# EAGLE design SCH1001-001-005-320 - Controller Flash (EAGLE 9.4.2)
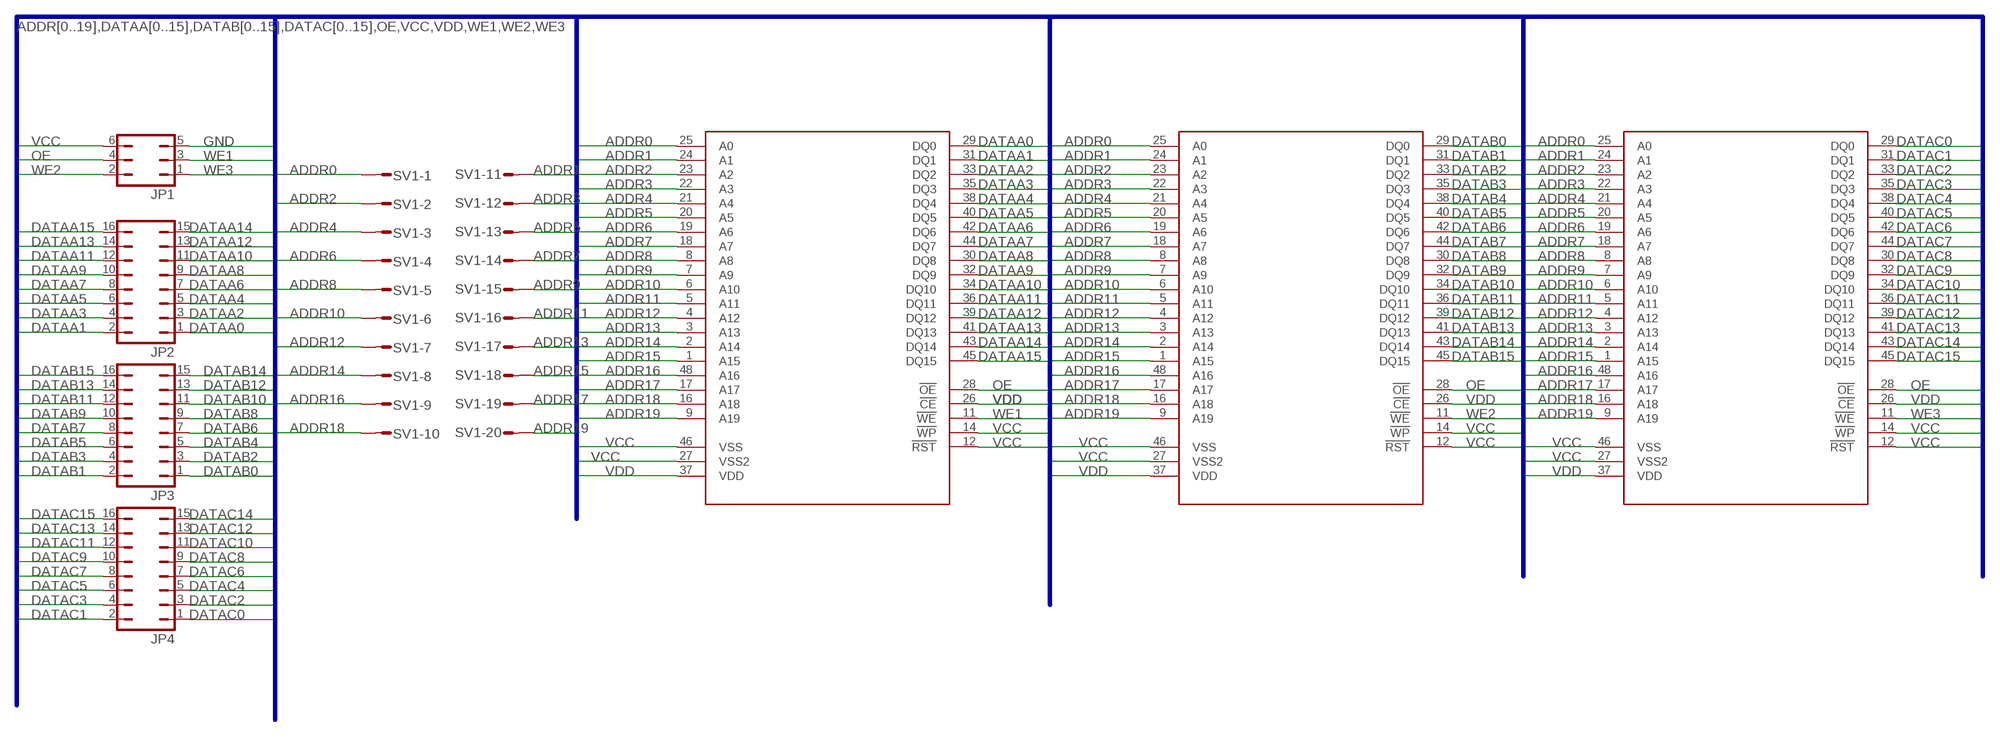
[diagram p0: schematic, sheet 1]

## Parts
JP1  JP3Q  [JP3Q]
JP2  JP8Q  [JP8Q]
JP3  JP8Q  [JP8Q]
JP4  JP8Q  [JP8Q]
SV1  S20P  [S20P]
U$1  SST39VF1602-70-4I-EKE  [TSOP48]
U$2  SST39VF1602-70-4I-EKE  [TSOP48]
U$3  SST39VF1602-70-4I-EKE  [TSOP48]

## Nets
ADDR0: SV1.1 U$1.25(A0) U$2.25(A0) U$3.25(A0)
ADDR1: SV1.11 U$1.24(A1) U$2.24(A1) U$3.24(A1)
ADDR2: SV1.2 U$1.23(A2) U$2.23(A2) U$3.23(A2)
ADDR3: SV1.12 U$1.22(A3) U$2.22(A3) U$3.22(A3)
ADDR4: SV1.3 U$1.21(A4) U$2.21(A4) U$3.21(A4)
ADDR5: SV1.13 U$1.20(A5) U$2.20(A5) U$3.20(A5)
ADDR6: SV1.4 U$1.19(A6) U$2.19(A6) U$3.19(A6)
ADDR7: SV1.14 U$1.18(A7) U$2.18(A7) U$3.18(A7)
ADDR8: SV1.5 U$1.8(A8) U$2.8(A8) U$3.8(A8)
ADDR9: SV1.15 U$1.7(A9) U$2.7(A9) U$3.7(A9)
ADDR10: SV1.6 U$1.6(A10) U$2.6(A10) U$3.6(A10)
ADDR11: SV1.16 U$1.5(A11) U$2.5(A11) U$3.5(A11)
ADDR12: SV1.7 U$1.4(A12) U$2.4(A12) U$3.4(A12)
ADDR13: SV1.17 U$1.3(A13) U$2.3(A13) U$3.3(A13)
ADDR14: SV1.8 U$1.2(A14) U$2.2(A14) U$3.2(A14)
ADDR15: SV1.18 U$1.1(A15) U$2.1(A15) U$3.1(A15)
ADDR16: SV1.9 U$1.48(A16) U$2.48(A16) U$3.48(A16)
ADDR17: SV1.19 U$1.17(A17) U$2.17(A17) U$3.17(A17)
ADDR18: SV1.10 U$1.16(A18) U$2.16(A18) U$3.16(A18)
ADDR19: SV1.20 U$1.9(A19) U$2.9(A19) U$3.9(A19)
DATAA0: JP2.1 U$1.29(DQ0)
DATAA1: JP2.2 U$1.31(DQ1)
DATAA2: JP2.3 U$1.33(DQ2)
DATAA3: JP2.4 U$1.35(DQ3)
DATAA4: JP2.5 U$1.38(DQ4)
DATAA5: JP2.6 U$1.40(DQ5)
DATAA6: JP2.7 U$1.42(DQ6)
DATAA7: JP2.8 U$1.44(DQ7)
DATAA8: JP2.9 U$1.30(DQ8)
DATAA9: JP2.10 U$1.32(DQ9)
DATAA10: JP2.11 U$1.34(DQ10)
DATAA11: JP2.12 U$1.36(DQ11)
DATAA12: JP2.13 U$1.39(DQ12)
DATAA13: JP2.14 U$1.41(DQ13)
DATAA14: JP2.15 U$1.43(DQ14)
DATAA15: JP2.16 U$1.45(DQ15)
DATAB0: JP3.1 U$2.29(DQ0)
DATAB1: JP3.2 U$2.31(DQ1)
DATAB2: JP3.3 U$2.33(DQ2)
DATAB3: JP3.4 U$2.35(DQ3)
DATAB4: JP3.5 U$2.38(DQ4)
DATAB5: JP3.6 U$2.40(DQ5)
DATAB6: JP3.7 U$2.42(DQ6)
DATAB7: JP3.8 U$2.44(DQ7)
DATAB8: JP3.9 U$2.30(DQ8)
DATAB9: JP3.10 U$2.32(DQ9)
DATAB10: JP3.11 U$2.34(DQ10)
DATAB11: JP3.12 U$2.36(DQ11)
DATAB12: JP3.13 U$2.39(DQ12)
DATAB13: JP3.14 U$2.41(DQ13)
DATAB14: JP3.15 U$2.43(DQ14)
DATAB15: JP3.16 U$2.45(DQ15)
DATAC0: JP4.1 U$3.29(DQ0)
DATAC1: JP4.2 U$3.31(DQ1)
DATAC2: JP4.3 U$3.33(DQ2)
DATAC3: JP4.4 U$3.35(DQ3)
DATAC4: JP4.5 U$3.38(DQ4)
DATAC5: JP4.6 U$3.40(DQ5)
DATAC6: JP4.7 U$3.42(DQ6)
DATAC7: JP4.8 U$3.44(DQ7)
DATAC8: JP4.9 U$3.30(DQ8)
DATAC9: JP4.10 U$3.32(DQ9)
DATAC10: JP4.11 U$3.34(DQ10)
DATAC11: JP4.12 U$3.36(DQ11)
DATAC12: JP4.13 U$3.39(DQ12)
DATAC13: JP4.14 U$3.41(DQ13)
DATAC14: JP4.15 U$3.43(DQ14)
DATAC15: JP4.16 U$3.45(DQ15)
GND: JP1.5
OE: JP1.4 U$1.28(!OE) U$2.28(!OE) U$3.28(!OE)
VCC: JP1.6 U$1.12(!RST) U$1.14(!WP) U$1.27(VSS2) U$1.46(VSS) U$2.12(!RST) U$2.14(!WP) U$2.27(VSS2) U$2.46(VSS) U$3.12(!RST) U$3.14(!WP) U$3.27(VSS2) U$3.46(VSS)
VDD: U$1.26(!CE) U$1.37(VDD) U$2.26(!CE) U$2.37(VDD) U$3.26(!CE) U$3.37(VDD)
WE1: JP1.3 U$1.11(!WE)
WE2: JP1.2 U$2.11(!WE)
WE3: JP1.1 U$3.11(!WE)

## Buses
ADDR[0..19],DATAA[0..15],DATAB[0..15],DATAC[0..15],OE,VCC,VDD,WE1,WE2,WE3

## Library data of the parts
JP1 = jumper:JP3Q: JUMPER
JP2-JP4 = jumper:JP8Q: JUMPER
SV1 = con-amp-mt:S20P: AMP MT CONNECTOR; OC_FARNELL: unknown; OC_NEWARK: unknown
U$1-U$3 = 16bit:SST39VF1602-70-4I-EKE

## Board
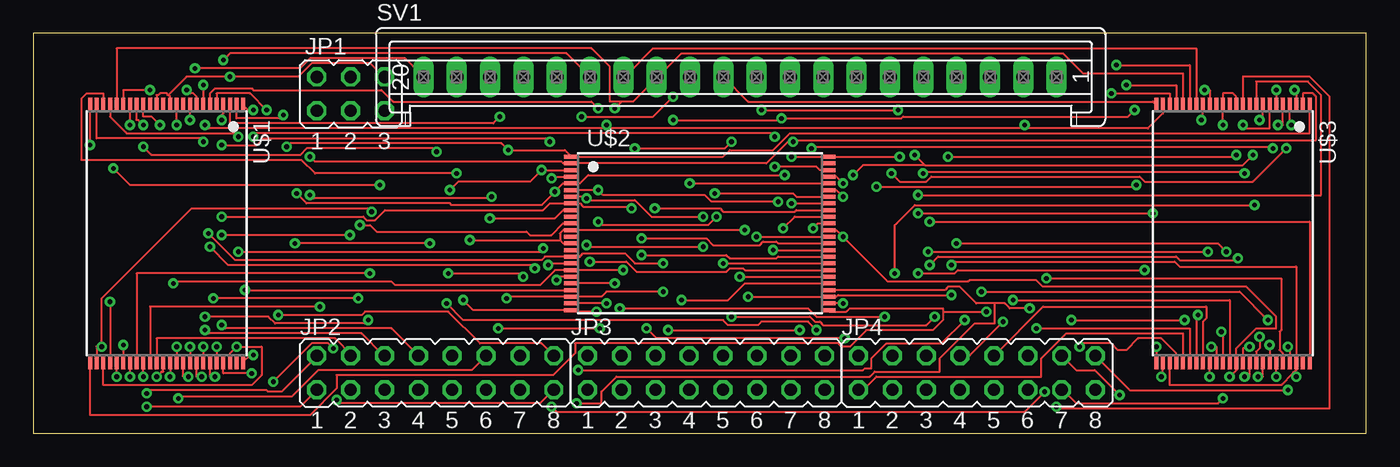
[diagram p1: board, top side]
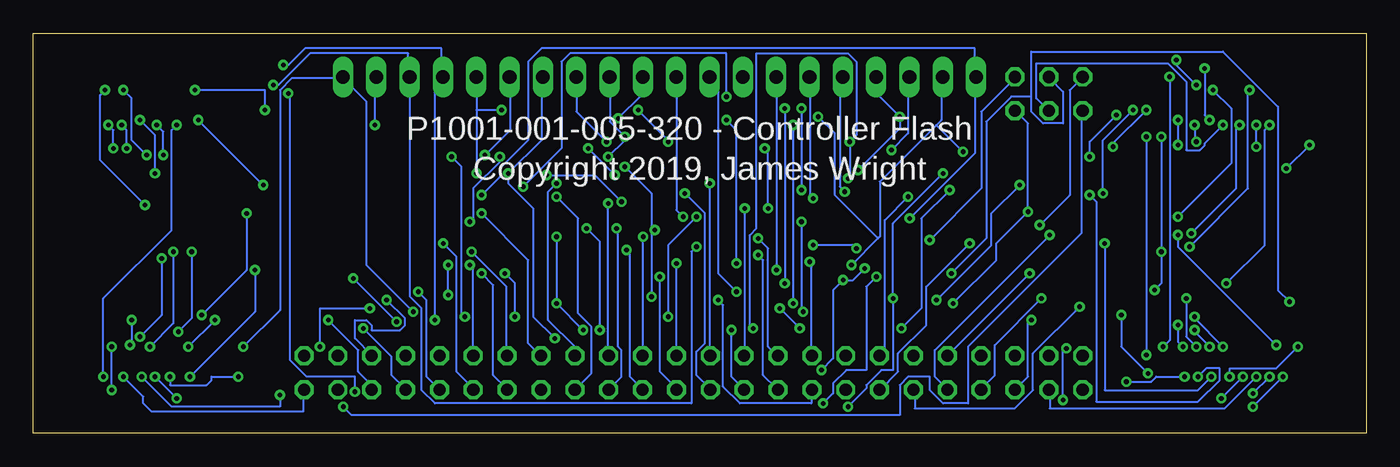
[diagram p2: board, bottom side, seen from below]

Size 100 x 30 mm. Coordinates in mm from the lower left corner, seen from the top.
Outline: 0,0 100,0 100,30 0,30 0,0
Copper layers (1*16): Top 0.035mm / dielectric 1.5mm / Bottom 0.035mm
Design rules "default": minimum track width 6mil, minimum drill 0.35mm, track to track 6mil, track to pad 6mil, pad to pad 6mil, via to via 6mil, smd to smd 6mil, copper to edge 40mil, drill to drill 6mil, minimum pad ring 10mil, minimum via ring 8mil, stop-mask expansion 4mil, vias tented up to drill 0mil, thermal gap 10mil

### Footprints (pad centres in the part's own frame; a part is rotated, then mirrored left to right if it is on the bottom)
JP3Q = drill 0.914 octagon: 1 -2.54,-1.27; 2 -2.54,1.27; 3 0,-1.27; 4 0,1.27; 5 2.54,-1.27; 6 2.54,1.27
JP8Q = drill 0.914 octagon: 1 -8.89,-1.27; 2 -8.89,1.27; 3 -6.35,-1.27; 4 -6.35,1.27; 5 -3.81,-1.27; 6 -3.81,1.27; 7 -1.27,-1.27; 8 -1.27,1.27; 9 1.27,-1.27; 10 1.27,1.27; 11 3.81,-1.27; 12 3.81,1.27; 13 6.35,-1.27; 14 6.35,1.27; 15 8.89,-1.27; 16 8.89,1.27
S20P = drill 1.016 long: 1 23.75,0; 2 21.25,0; 3 18.75,0; 4 16.25,0; 5 13.75,0; 6 11.25,0; 7 8.75,0; 8 6.25,0; 9 3.75,0; 10 1.25,0; 11 -1.25,0; 12 -3.75,0; 13 -6.25,0; 14 -8.75,0; 15 -11.25,0; 16 -13.75,0; 17 -16.25,0; 18 -18.75,0; 19 -21.25,0; 20 -23.75,0
TSOP48 = smd 1.1 x 0.3: 1 -9.625,5.75; 2 -9.625,5.25; 3 -9.625,4.75; 4 -9.625,4.25; 5 -9.625,3.75; 6 -9.625,3.25; 7 -9.625,2.75; 8 -9.625,2.25; 9 -9.625,1.75; 10 -9.625,1.25; 11 -9.625,0.75; 12 -9.625,0.25; 13 -9.625,-0.25; 14 -9.625,-0.75; 15 -9.625,-1.25; 16 -9.625,-1.75; 17 -9.625,-2.25; 18 -9.625,-2.75; 19 -9.625,-3.25; 20 -9.625,-3.75; 21 -9.625,-4.25; 22 -9.625,-4.75; 23 -9.625,-5.25; 24 -9.625,-5.75; 25 9.625,-5.75; 26 9.625,-5.25; 27 9.625,-4.75; 28 9.625,-4.25; 29 9.625,-3.75; 30 9.625,-3.25; 31 9.625,-2.75; 32 9.625,-2.25; 33 9.625,-1.75; 34 9.625,-1.25; 35 9.625,-0.75; 36 9.625,-0.25; 37 9.625,0.25; 38 9.625,0.75; 39 9.625,1.25; 40 9.625,1.75; 41 9.625,2.25; 42 9.625,2.75; 43 9.625,3.25; 44 9.625,3.75; 45 9.625,4.25; 46 9.625,4.75; 47 9.625,5.25; 48 9.625,5.75

### Placement (x,y rotation side)
JP1  23.81,25.46 0 top
JP2  30.16,4.54 0 top
JP3  50.48,4.54 0 top
JP4  70.8,4.54 0 top
SV1  53.02,26.73 0 top
U$1  10,15 270 top
U$2  50,15 0 top
U$3  90,15 270 top

### Tracks (layer width: path | path; a pad name or v marks a point on that pad's centre or on a via)
ADDR0  (via drill 0.35)
  Top 0.152: v84.25,6.5 U$3.25 | U$1.25 4.25,1.38 20.75,1.38 22.75,3.38 22.75,4.38 39,4.38 40.62,6 40.62,6.75 60.38,6.75 60.62,6.5 61.25,6.5 62.5,7.75 67.5,7.75 68.25,8.5 68.25,9.12 | 68.25,9.12 68.25,9.38 61.25,9.38 61,9.12 59.75,9.12 U$2.25 | 68.25,9.12 v71.5,9.12
  Bottom 0.152: v84.25,6.5 81.5,9.25 81.5,25.75 80.62,26.62 76.88,26.62 SV1.1 76.75,26.62 75,24.88 75,12.62 v71.5,9.12
ADDR1  (via drill 0.35)
  Top 0.152: v42.25,9.12 40.5,9.12 U$2.24 33,9.25 v32.25,10 | v42.38,15.88 42.62,15.62 50.62,15.62 v51.25,16.25 | v4.25,21.62 U$1.24 | v6,19.88 7.25,18.62 v26,18.62 | U$3.24 84,24.88 53.62,24.88 SV1.11
  Bottom 0.152: v42.25,9.12 42.38,9.25 v42.38,15.88 | v51.25,16.25 51.75,16.75 51.75,26.62 SV1.11 | v6,19.88 v4.25,21.62 | v26,18.62 28.12,16.5 28.12,14.12 v32.25,10
ADDR2  (via drill 0.35)
  Top 0.152: U$1.23 4.75,22.12 12.5,22.12 v12.75,21.88 | v12.88,23.12 13.12,22.88 43,22.88 | 74.38,22.88 83.62,22.88 84.75,24 U$3.23 | 74.38,22.88 43,22.88 | v43,9.75 U$2.23 | 43,22.88 v43,23.12 | 74.38,22.88 v74.38,23.12
  Bottom 0.152: v12.75,21.88 12.88,22 v12.88,23.12 | v43,23.12 v43,9.75 | v74.38,23.12 74.38,26.62 SV1.2
ADDR3  (via drill 0.35)
  Top 0.152: v47.25,10.62 43,10.62 42.62,10.25 U$2.22 35.62,10.25 v35.5,10.12 | U$1.22 5.25,25.5 4,25.5 3.62,25.12 3.62,20.5 20.12,20.5 21.12,19.5 v31.75,19.5 | U$3.22 85.25,25.5 v80.88,25.5 | v75.88,3.12 74.38,1.62 39.25,1.62 v38.88,2
  Bottom 0.152: v47.25,10.62 48.62,12 48.62,26 49.25,26.62 SV1.12 | v31.75,19.5 35.5,15.75 v35.5,10.12 35.5,4.75 36.38,4.75 37.5,3.62 37.5,3.38 v38.88,2 | v80.88,25.5 80.75,25.38 80.75,5.5 79.5,4.25 75.88,4.25 v75.88,3.12
ADDR4  (via drill 0.35)
  Top 0.152: U$3.21 85.75,26.12 v82,26.12 | v15.88,10.75 U$2.21 | v15.38,22.25 15.12,22.5 7,22.5 5.75,23.75 U$1.21 | v50.25,14 41.62,14 v41.5,14.12 | v38.25,13.88 38,13.62 v15.38,13.62
  Bottom 0.152: v82,26.12 81.62,26.12 79.25,28.5 71.88,28.5 71.88,26.75 SV1.3 71.75,26.62 71.75,10.25 70.88,9.38 70.88,3.25 69.88,2.25 50.62,2.25 50.62,13.62 v50.25,14 | v15.88,10.75 15.38,11.25 v15.38,13.62 v15.38,22.25 | v41.5,14.12 38.25,14.12 v38.25,13.88
ADDR5  (via drill 0.35)
  Top 0.152: v43.62,11.25 U$2.20 | 44.12,24.88 v43.62,24.38 | 44.12,24.88 45,24.88 46.75,26.62 SV1.13 46.88,26.75 48.62,28.5 77.25,28.5 78.75,27 86.25,27 U$3.20 | U$1.20 6.25,28.88 41.88,28.88 43.25,27.5 43.25,24.88 44.12,24.88
  Bottom 0.152: v43.62,24.38 v43.62,11.25
ADDR6  (via drill 0.35)
  Top 0.152: U$3.19 86.75,27.62 v81.25,27.62 | U$1.19 6.75,25.75 v8.75,25.75 | v13.25,14 14.62,12.62 37.38,12.62 v37.62,12.38 | v39.25,11.5 39.5,11.75 U$2.19 | v69.88,8.5 68.12,6.75 64,6.75 62.88,5.62 62.88,4.88 62.38,4.88 62.25,4.75 v40.88,4.75
  Bottom 0.152: v81.25,27.62 80.88,27.62 79.62,28.88 69.38,28.88 69.38,26.75 SV1.4 69.88,26.12 v69.88,8.5 | v8.75,25.75 8.88,25.62 8.88,18.38 v13.25,14 | v37.62,12.38 38.5,11.5 v39.25,11.5 40,10.75 40,5.62 v40.88,4.75
ADDR7  (via drill 0.35)
  Top 0.152: v44.25,12.25 U$2.18 39.12,12.25 38,11.12 27.12,11.12 26.88,11.38 10.62,11.38 v10.5,11.25 | v7.25,23.12 U$1.18 | U$3.18 87.25,28.88 46.5,28.88 44.38,26.75 SV1.14
  Bottom 0.152: v44.25,12.25 44.25,26.62 SV1.14 | v7.25,23.12 7.62,22.75 7.62,14.12 v10.5,11.25
ADDR8  (via drill 0.35)
  Top 0.152: U$3.8 92.25,23.5 v92,23.5 | v90.88,19.5 90.75,19.62 66.88,19.62 v66.75,19.5 | v14.12,16.25 24.75,16.25 25,16 25.62,16 26.38,16.75 38.25,16.75 38.75,17.25 U$2.8 41,17.25 41.25,17 44.75,17 v44.88,16.88 | v11.5,25.75 11.75,25.5 12,25.5 12.25,25.25 U$1.8 | v54.62,24.25 v64.88,24.25 | v52.38,21.88 51.88,21.38 v45.12,21.38
  Bottom 0.152: v92,23.5 90.88,22.38 v90.88,19.5 | 66.75,24.25 66.75,26.62 SV1.5 | 66.75,24.25 v66.75,19.5 | v14.12,16.25 10.12,20.25 10.12,24.38 v11.5,25.75 | v64.88,24.25 66.75,24.25 | v54.62,24.25 52.38,22 v52.38,21.88 | v45.12,21.38 44.88,21.12 v44.88,16.88
ADDR9  (via drill 0.35)
  Top 0.152: U$2.7 41.38,17.75 v41.5,17.62 41.62,17.5 45.12,17.5 46.38,16.25 v50.25,16.25 | v12.75,26.12 U$1.7 | v14.25,28 14.75,28.5 40,28.5 SV1.15 | U$3.7 92.75,22.88 91,22.88 v90.75,23.12 | v90.25,20.88 90.12,20.75 v68.62,20.75 | v67.62,8.75 67,8.12 59.25,8.12 59,8.38 58.62,8.38 58.25,8.75 v52.38,8.75
  Bottom 0.152: v41.5,17.62 41.75,17.88 41.75,26.62 SV1.15 | v12.75,26.12 14.25,27.62 v14.25,28 | v90.75,23.12 90.25,22.62 v90.25,20.88 | v68.62,20.75 67.88,20 67.88,9 v67.62,8.75 | v52.38,8.75 52.38,14.12 v50.25,16.25
ADDR10  (via drill 0.35)
  Top 0.152: U$2.6 v42.38,18.25 42.75,17.88 50.38,17.88 50.88,17.38 v55.88,17.38 | v42.38,24.38 41.88,24.88 27,24.88 26.12,25.75 16.5,25.75 16.38,25.88 13.62,25.88 13.25,25.5 U$1.6 | v93.25,25.75 U$3.6 | v91.5,20.88 90.75,20.12 66.88,20.12 | v66.12,20.88 66.88,20.12 | v61.5,19.38 62.25,20.12 66.88,20.12
  Bottom 0.152: v42.38,24.38 v42.38,18.25 | v93.25,25.75 92.62,25.12 92.62,22 v91.5,20.88 | v66.12,20.88 64.25,22.75 64.25,26.62 SV1.6 | v55.88,17.38 57.88,19.38 v61.5,19.38
ADDR11  (via drill 0.35)
  Top 0.152: U$1.5 13.75,25.5 16.25,25.5 v17.5,24.25 | v19.75,18 20.5,17.25 31.25,17.25 31.38,17.12 38.12,17.12 v39.12,18.12 39.75,18.75 U$2.5 41,18.75 41.62,19.38 v56.38,19.38 | U$3.5 93.75,23.12 v93.38,23.12 | v93,21.38 92.88,21.5 58.5,21.5 v58.38,21.38
  Bottom 0.152: v39.12,18.12 39.5,18.5 39.5,26.5 SV1.16 | v17.5,24.25 19.75,22 v19.75,18 | v93.38,23.12 93,22.75 v93,21.38 | v56.38,19.38 v58.38,21.38
ADDR12  (via drill 0.35)
  Top 0.152: U$2.4 39,19.25 v38.88,19.12 | v38.75,21.88 38.5,22.12 17.25,22.12 16.75,21.62 v14.12,21.62 | v14.12,23.5 14.12,23.88 14.25,24 U$1.4 | U$3.4 94.25,23.12 v94.38,23.12 | v94,21.38 91.5,18.88 83.38,18.88 83,19.25 67.38,19.25 67,18.88 65,18.88 v64.38,19.5 | v46,7.88 46.75,7.12 v60.88,7.12
  Bottom 0.152: v38.88,19.12 38.75,19.25 v38.75,21.88 38.25,22.38 38.25,27.88 38.88,28.5 45.75,28.5 45.75,15.38 46.25,14.88 46.25,8.12 v46,7.88 | v14.12,23.5 v14.12,21.62 | v94.38,23.12 94,22.75 v94,21.38 | SV1.7 61.88,26.62 61.88,22 v64.38,19.5 64.38,18.75 62.5,16.88 62.5,8.75 v60.88,7.12
ADDR13  (via drill 0.35)
  Top 0.152: U$1.3 14.75,23.25 34.5,23.25 v35,23.75 | U$2.3 v38.12,19.75 37.25,18.88 31.88,18.88 v31.25,18.25 | U$3.3 94.75,25.75 v94.62,25.75 | v91.62,17.12 66.12,17.12 64.62,15.62 v64.62,12 | v63.88,8.75 58.75,8.75 58.12,9.38 v44,9.38 | v34.88,7.88 v42.5,7.88
  Bottom 0.152: SV1.17 36.75,26.62 36.75,25.5 v35,23.75 35,22.88 v38.12,19.75 | v94.62,25.75 95,25.38 95,20.5 v91.62,17.12 | v64.62,12 63.88,11.25 v63.88,8.75 | v42.5,7.88 v44,9.38 | v34.88,7.88 33.38,9.38 33.38,16.12 v31.25,18.25
ADDR14  (via drill 0.35)
  Top 0.152: U$1.2 15.25,23.62 18.5,23.62 v18.75,23.88 | v20.75,20.75 21.12,20.38 39.62,20.38 39.75,20.25 U$2.2 55,20.25 56.62,21.88 v57,21.88 57.12,22 96.25,22 96.25,25.25 96,25.5 95.25,25.5 U$3.2
  Bottom 0.152: v57,21.88 59.25,24.12 59.25,26.62 SV1.8 | v18.75,23.88 20.75,21.88 v20.75,20.75
ADDR15  (via drill 0.35)
  Top 0.152: U$1.1 16.12,24.25 v16.5,24.25 | v19,21.5 19.25,21.75 35.12,21.75 v35.62,21.25 39.88,21.25 U$2.1 51.75,20.75 52.25,21.25 55.5,21.25 56.75,22.5 95.75,22.5 U$3.1
  Bottom 0.152: v35.62,21.25 34.38,22.5 34.38,26.62 SV1.18 | v16.5,24.25 19,21.75 v19,21.5
ADDR16  (via drill 0.35)
  Top 0.152: U$1.48 16.25,5.88 v16.5,5.88 | v16.5,22.25 16.75,22.5 55.38,22.5 v55.62,22.25 | v56.88,20.75 U$2.48 v65,20.75 | U$3.48 95.75,15.88 v67.25,15.88
  Bottom 0.152: v16.5,22.25 v16.5,5.88 | SV1.9 56.75,26.62 56.75,23.38 v55.62,22.25 55.62,22 v56.88,20.75 | v67.25,15.88 67,16.12 67,18.38 65,20.38 v65,20.75
ADDR17  (via drill 0.35)
  Top 0.152: U$2.17 38.75,12.75 v38.62,12.62 | U$1.17 7.75,23.5 7.88,23.5 v8.25,23.12 | v8.25,21.5 8.88,20.88 20,20.88 20.5,21.38 30,21.38 v30.25,21.12 | U$3.17 87.75,23.5 v87.62,23.5 | v82.75,18.62 82.62,18.5 v63.25,18.5 | v48,25.25 46.5,23.75 v41.12,23.75
  Bottom 0.152: 36.62,14.62 36.5,14.75 36.5,18.88 32.25,23.12 | 36.62,14.62 v38.62,12.62 | 32.25,23.12 31.88,23.5 31.88,26.62 SV1.19 | v8.25,21.5 v8.25,23.12 | 32.25,23.12 v30.25,21.12 | v82.75,18.62 v87.62,23.5 | v63.25,18.5 60.38,21.38 60.38,27.88 59.75,28.5 48,28.5 v48,25.25 | v41.12,23.75 39.88,22.5 39.88,17.88 36.62,14.62
ADDR18  (via drill 0.35)
  Top 0.152: U$3.16 88.25,25.75 v87.88,25.75 | v82.62,24.25 82.12,23.75 65.25,23.75 65.12,23.62 v56.12,23.62 56,23.5 v48,23.5 | U$1.16 8.25,23.75 8.88,23.75 v9.5,23.12 | v13.12,15 15.12,13 38.12,13 38.38,13.25 U$2.16 41,13.25 41.25,13.5 44.38,13.5 45.12,12.75 v47.25,12.75
  Bottom 0.152: v87.88,25.75 82.62,25.75 v82.62,24.25 | v56.12,23.62 54.38,25.38 54.38,26.62 SV1.10 | v9.5,23.12 9.75,22.88 9.75,18.38 v13.12,15 | v48,23.5 47.25,22.75 v47.25,12.75
ADDR19  (via drill 0.35)
  Top 0.152: v11.75,23.5 U$1.9 | v12.12,27.38 20,27.38 20.75,28.12 27.88,28.12 SV1.20 | U$2.9 39.75,16.75 39.12,16.12 v34.25,16.12 | U$3.9 91.75,26.38 95.62,26.38 96.62,25.38 96.62,17.88 v66.38,17.88
  Bottom 0.152: v11.75,23.5 12.12,23.88 v12.12,27.38 | v34.25,16.12 29.38,21 29.38,26.62 SV1.20 29.38,26.75 29.38,28.88 61.88,28.88 62.88,27.88 62.88,22 65,19.88 65,19.25 v66.38,17.88
DATAA0  (via drill 0.35)
  Top 0.152: v6.25,4.25 U$1.29 | v8.5,2 20,2 21.25,3.25 JP2.1
  Bottom 0.152: v8.5,2 v6.25,4.25
DATAA1  (via drill 0.35)
  Top 0.152: v7.25,4.25 U$1.31 | v8.5,3 8.75,3.25 17.5,3.25 17.62,3.12 18.62,3.12 21.25,5.75 JP2.2
  Bottom 0.152: v8.5,3 v7.25,4.25
DATAA2  (via drill 0.35)
  Top 0.152: v8.25,4.25 U$1.33
  Bottom 0.152: v8.25,4.25 10.62,1.88 23.75,1.88 23.75,3.25 JP2.3
DATAA3
  Top 0.152: U$1.35 9.25,7.12 22.62,7.12 23.88,5.88 JP2.4
DATAA4  (via drill 0.35)
  Top 0.152: v10.75,6.5 U$1.38 | v12.88,8.75 17.62,8.75 18.12,8.25 24.88,8.25 v25.12,8.5
  Bottom 0.152: v10.75,6.5 12.88,8.62 v12.88,8.75 | v25.12,8.5 25.38,8.25 25.38,4.25 26.25,3.38 JP2.5
DATAA5  (via drill 0.35)
  Top 0.152: v11.75,6.5 U$1.40 | v12.88,7.75 13.12,7.5 24.62,7.5 26.25,5.88 JP2.6
  Bottom 0.152: v11.75,6.5 12.88,7.62 v12.88,7.75
DATAA6  (via drill 0.35)
  Top 0.152: v12.75,6.5 U$1.42 | v24.38,10.12 v13.5,10.12
  Bottom 0.152: v12.75,6.5 13.5,7.25 v13.5,10.12 | v24.38,10.12 27.88,6.62 27.88,4.38 28.88,3.38 JP2.7
DATAA7  (via drill 0.35)
  Top 0.152: v13.75,6.5 U$1.44 | v14.12,8.12 14.38,7.88 26.88,7.88 28.88,5.88 JP2.8
  Bottom 0.152: v13.75,6.5 14.12,6.88 v14.12,8.12
DATAA8  (via drill 0.35)
  Top 0.152: v6.75,6.62 U$1.30 | v23.75,14.88 v14.12,14.88
  Bottom 0.152: v6.75,6.62 14.12,14 v14.12,14.88 | v23.75,14.88 32.38,6.25 32.38,4.25 31.5,3.38 JP2.9
DATAA9  (via drill 0.35)
  Top 0.152: U$1.32 7.75,12 v25.25,12
  Bottom 0.152: v25.25,12 31.38,5.88 JP2.10
DATAA10  (via drill 0.35)
  Top 0.152: U$1.34 8.75,9.5 v21.5,9.5
  Bottom 0.152: v21.5,9.5 25,6 25,3.25 26.38,1.88 33.88,1.88 33.88,3.25 JP2.11
DATAA11  (via drill 0.35)
  Top 0.152: U$1.36 9.75,4.62 9.62,4.62 v9.25,4.25 | v10.88,2.62 11,2.75 19.38,2.75 21.38,4.75 32.88,4.75 33.88,5.75 JP2.12
  Bottom 0.152: v10.88,2.62 v9.25,4.25
DATAA12  (via drill 0.35)
  Top 0.152: U$1.39 11.25,4.25 v11.62,4.25 | v29.75,14.25 v19.62,14.25
  Bottom 0.152: v11.62,4.25 12.62,3.25 19.62,3.25 v19.62,14.25 | v29.75,14.25 33,11 33,8.12 35.12,6 35.12,4.62 36.5,3.25 JP2.13
DATAA13  (via drill 0.35)
  Top 0.152: U$1.41 12.25,4.25 v12.62,4.25 | v20.75,17.88 21,17.62 34.25,17.62 v34.38,17.75
  Bottom 0.152: v12.62,4.25 12,4.88 11,4.88 11,4 12.62,2.38 20.25,2.38 20.25,17.38 v20.75,17.88 | v34.38,17.75 36.12,16 36.12,6.25 36.5,5.88 JP2.14
DATAA14  (via drill 0.35)
  Top 0.152: U$1.43 13.25,4.25 v13.62,4.25 | v18,3.88 20.88,6.75 22.12,6.75 v22.5,6.38 | v22.75,2.5 23,2.25 38,2.25 39,3.25 JP2.15
  Bottom 0.152: v13.62,4.25 15.75,4.25 16.12,3.88 v18,3.88 | v22.5,6.38 22.75,6.12 v22.75,2.5
DATAA15  (via drill 0.35)
  Top 0.152: U$1.45 14.25,4.5 v16.38,4.5 | v18.38,8.88 24.62,8.88 24.88,9.12 31.12,9.12 33.5,6.75 38.12,6.75 39,5.88 JP2.16
  Bottom 0.152: v16.38,4.5 18.38,6.5 v18.38,8.88
DATAB0  (via drill 0.35)
  Top 0.152: U$2.29 53.38,11.25 52.12,10 v48.62,10
  Bottom 0.152: v48.62,10 48.25,9.62 48.25,3.5 47,2.25 41.62,2.25 41.62,3.25 JP3.1
DATAB1  (via drill 0.35)
  Top 0.152: U$2.31 53.38,12.25 53.25,12.38 52.25,12.38 52,12.12 45.25,12.12 44.5,12.88 v41.75,12.88
  Bottom 0.152: v41.75,12.88 41.62,12.75 41.62,5.88 JP3.2
DATAB2  (via drill 0.35)
  Top 0.152: U$2.33 55.88,13.25 55.75,13.12 52.25,13.12 52,13.38 v45.62,13.38
  Bottom 0.152: v45.62,13.38 45.25,13 45.25,4.38 44.25,3.38 JP3.3
DATAB3  (via drill 0.35)
  Top 0.152: U$2.35 55.88,14.25 55.75,14.38 54.75,14.38 54.5,14.12 51,14.12 50.5,14.62 v45.62,14.62
  Bottom 0.152: v45.62,14.62 44.88,13.88 44.88,6.5 44.25,5.88 JP3.4
DATAB4  (via drill 0.35)
  Top 0.152: U$2.38 58.88,15.75 v58.5,15.38 | v47.62,7.75 v57.5,7.75
  Bottom 0.152: v58.5,15.38 57.5,14.38 v57.5,7.75 | v47.62,7.75 47.62,4.25 46.75,3.38 JP3.5
DATAB5  (via drill 0.35)
  Top 0.152: U$2.40 57.25,16.75 57.12,16.62 51.75,16.62 51.5,16.88 v46.62,16.88
  Bottom 0.152: v46.62,16.88 46.62,5.88 JP3.6
DATAB6  (via drill 0.35)
  Top 0.152: U$2.42 57.25,17.75 57,18 v51.12,18
  Bottom 0.152: v51.12,18 49.62,16.5 49.62,6.75 50.25,6.12 50.25,4.38 49.25,3.38 JP3.7
DATAB7  (via drill 0.35)
  Top 0.152: v49.25,18.75 U$2.44
  Bottom 0.152: v49.25,18.75 49.25,5.88 JP3.8
DATAB8  (via drill 0.35)
  Top 0.152: v53,11.75 U$2.30
  Bottom 0.152: v53,11.75 53,4.62 51.75,3.38 JP3.9
DATAB9  (via drill 0.35)
  Top 0.152: v51.75,12.75 U$2.32
  Bottom 0.152: JP3.10 v51.75,12.75
DATAB10  (via drill 0.35)
  Top 0.152: v55.5,13.75 U$2.34
  Bottom 0.152: v55.5,13.75 55.25,13.5 55.25,4.25 54.38,3.38 JP3.11
DATAB11  (via drill 0.35)
  Top 0.152: v54.25,14.75 U$2.36
  Bottom 0.152: v54.25,14.75 54.25,5.88 JP3.12
DATAB12  (via drill 0.35)
  Top 0.152: U$2.39 57.12,16.25 v56.25,15.38
  Bottom 0.152: v56.25,15.38 56.12,15.25 56.12,6.5 55.88,6.25 55.88,4.25 56.75,3.38 JP3.13
DATAB13  (via drill 0.35)
  Top 0.152: v56.88,17.25 U$2.41
  Bottom 0.152: v56.88,17.25 56.88,5.88 JP3.14
DATAB14  (via drill 0.35)
  Top 0.152: U$2.43 60.25,18.25 v60.75,17.75
  Bottom 0.152: v60.75,17.75 59.12,16.12 59.12,9 58.12,8 58.12,4.5 59.25,3.38 JP3.15
DATAB15  (via drill 0.35)
  Top 0.152: U$2.45 60.25,19.25 v60.75,18.75
  Bottom 0.152: v60.75,18.75 61.38,18.12 61.38,8.5 59.38,6.5 59.38,5.88 JP3.16
DATAC0
  Top 0.152: U$3.29 86.25,7.5 77.5,7.5 75.62,5.62 75.62,4.25 63.25,4.25 62.38,3.38 62,3.38 JP4.1
DATAC1  (via drill 0.35)
  Top 0.152: U$3.31 87.25,8.88 v87.38,8.88 | v66.38,16.5 v84,16.5
  Bottom 0.152: v87.38,8.88 84,12.25 v84,16.5 | v66.38,16.5 62.88,13 62.88,6.75 62,5.88 JP4.2
DATAC2  (via drill 0.35)
  Top 0.152: v88.25,4.25 U$3.33 | v83.38,12.25 69.38,12.25 69.12,12 v66.38,12
  Bottom 0.152: v88.25,4.25 83.38,9.12 v83.38,12.25 | v66.38,12 65.5,11.12 65.5,4.38 64.5,3.38 JP4.3
DATAC3  (via drill 0.35)
  Top 0.152: U$3.35 89.25,7.62 v89.12,7.62 | v67.12,13.62 v88.12,13.62
  Bottom 0.152: v89.12,7.62 88.12,8.62 v88.12,13.62 | v67.12,13.62 64.5,11 64.5,5.88 JP4.4
DATAC4  (via drill 0.35)
  Top 0.152: U$3.38 90.75,6.38 91.12,6.38 v91.25,6.5 | v89.5,13.62 88.88,14.25 v69.25,14.25
  Bottom 0.152: v91.25,6.5 89.5,8.25 v89.5,13.62 | v69.25,14.25 68.25,13.25 68.25,4.62 67,3.38 JP4.5
DATAC5  (via drill 0.35)
  Top 0.152: U$3.40 91.75,6.12 92,6.38 v92,7.25 | v90.38,13.12 90.25,13 86,13 85.75,13.25 67.88,13.25 v67.25,12.62
  Bottom 0.152: v92,7.25 90.38,8.88 v90.38,13.12 | v67.25,12.62 67,12.38 67,5.88 JP4.6
DATAC6  (via drill 0.35)
  Top 0.152: v92.75,6.62 U$3.42 | v92.62,8.5 90.5,10.62 v71.12,10.62
  Bottom 0.152: v92.75,6.62 92.62,6.75 v92.62,8.5 | v71.12,10.62 70.5,10 70.5,4.25 69.62,3.38 JP4.7
DATAC7  (via drill 0.35)
  Top 0.152: U$3.44 93.75,6 93.5,6.25 93.5,7.62 93.62,7.75 93.62,11.62 v76,11.62 | v72.75,8.38 70.25,5.88 69.62,5.88 JP4.8
  Bottom 0.152: v72.75,8.38 v76,11.62
DATAC8  (via drill 0.35)
  Top 0.152: U$3.30 86.75,7.88 v75.25,7.88
  Bottom 0.152: v75.25,7.88 73.12,5.75 73.12,4.38 72.12,3.38 JP4.9
DATAC9
  Top 0.152: U$3.32 87.75,8.38 88,8.62 88,9.5 75.75,9.5 72.12,5.88 JP4.10
DATAC10  (via drill 0.35)
  Top 0.152: U$3.34 88.75,6.5 v88.38,6.5 | v77.88,8.5 v86.38,8.5
  Bottom 0.152: v86.38,8.5 v88.38,6.5 | v77.88,8.5 75.62,6.25 75.62,4.62 74.62,3.62 74.62,3.38 JP4.11
DATAC11  (via drill 0.35)
  Top 0.152: U$3.36 89.75,10 v73.5,10
  Bottom 0.152: v73.5,10 72.12,8.62 72.12,8.12 72.5,7.75 74.62,7.75 74.62,8.12 75,8.5 75.88,8.5 75.88,7.12 74.62,5.88 JP4.12
DATAC12  (via drill 0.35)
  Top 0.152: U$3.39 91.25,4.25 v90.88,4.25 | v89.25,2.62 88.88,2.25 78.25,2.25 77.25,3.25 JP4.13
  Bottom 0.152: v89.25,2.62 v90.88,4.25
DATAC13  (via drill 0.35)
  Top 0.152: U$3.41 92.25,4.25 v91.88,4.25 | v81.5,2.88 79.62,4.75 78.25,4.75 77.25,5.75 JP4.14
  Bottom 0.152: v91.88,4.25 89.62,2 81.5,2 v81.5,2.88
DATAC14  (via drill 0.35)
  Top 0.152: v93.25,4.25 U$3.43
  Bottom 0.152: v93.25,4.25 91.75,2.75 91.75,2.25 91.12,1.62 79.75,1.62 79.75,3.25 JP4.15
DATAC15  (via drill 0.35)
  Top 0.152: U$3.45 94.25,6.5 v94.12,6.5 | v94.12,3.25 82.25,3.25 JP4.16
  Bottom 0.152: v94.12,3.25 v94.12,6.5
OE  (via drill 0.35)
  Top 0.152: U$2.28 68.38,10.75 68.62,11 69.5,11 70.75,9.75 72.12,9.75 | 72.12,9.75 72.88,9.75 73.25,9.38 v74.75,9.38 | v78.5,6.5 78.75,6.75 80.88,6.75 81.38,6.25 82,6.25 82.88,7.12 84.62,7.12 85.75,6 U$3.28 | v5.75,9.88 U$1.28 | 72.12,9.75 72.12,8.25 70.62,8.25 68,5.62 68,4.62 63.12,4.62 62.75,4.25 43.75,4.25 42.62,3.12 42.62,2.25 v40.75,2.25 | v36.75,11.75 36.5,12 v31.12,12
  Bottom 0.152: v74.75,9.38 78.5,9.38 v78.5,6.5 | v5.75,9.88 6.62,10.75 6.62,24.5 10.75,28.62 25.12,28.62 25.12,25.25 | 25.12,25.25 25.12,24.12 24.25,23.25 22.75,23.25 22.75,25.62 23.75,26.62 JP1.4 | v40.75,2.25 40,3 40,3.75 39,4.75 37.5,4.75 37.5,11 v36.75,11.75 | v31.12,12 28.5,14.62 28.5,23.38 26.62,25.25 25.12,25.25
VCC  (via drill 0.35)
  Top 0.152: U$3.12 90.25,25.25 90,25.5 89.25,25.5 U$3.14 v89.25,23.12 | U$3.27 85.25,3.62 93.62,3.62 94.5,4.5 | 94.5,4.5 94.75,4.75 U$3.46 94.75,12.5 86,12.5 85.62,12.88 69.12,12.88 v68.88,12.62 | 94.5,4.5 v94.75,4.25 | U$2.14 39.75,14.25 39.5,14.5 | 39.5,14.5 39.5,15 39.75,15.25 U$2.12 v53.38,15.25 | v53.62,10.25 U$2.27 60.25,10.25 60.38,10.38 v68.88,10.38 | v55.62,20 58.75,20 59,19.75 U$2.46 | U$1.27 5.25,3.62 16.38,3.62 17.12,4.38 17.12,6.5 v15.25,6.5 14.75,6 U$1.46 | U$1.14 9.25,25.38 9.38,25.38 9.5,25.5 10,25.5 10.12,25.38 | 10.12,25.38 10.25,25.25 U$1.12 | 10.12,25.38 11.5,26.75 v14.75,26.75 19.88,26.75 20.88,27.75 25.25,27.75 26.25,26.75 JP1.6 | v32.75,14.5 39.5,14.5
  Bottom 0.152: v89.25,23.12 89.62,22.75 89.62,15.25 94.75,10.12 v94.75,4.25 | 53.62,15.25 53.62,18 v55.62,20 | 53.62,15.25 v53.62,10.25 | 53.62,15.25 v53.38,15.25 | v15.25,6.5 14.75,7 v14.75,26.75 | v32.75,14.5 28.88,18.38 28.88,24.12 26.38,26.62 JP1.6 | v68.88,10.38 v68.88,12.62
VDD  (via drill 0.35)
  Top 0.152: U$1.26 4.75,6.5 v5.12,6.5 5.12,10.12 11.88,16.88 25.12,16.88 v25.38,16.62 | U$1.37 v10.25,4.25 | v60.75,9.75 U$2.26 | U$2.37 60.25,15.25 v60.75,14.75 64.12,11.38 70.12,11.38 70.25,11.5 75.25,11.5 75.75,11 91,11 93.25,8.75 93.25,7.88 91.75,7.88 90.25,6.38 U$3.37 90.25,4.75 v89.75,4.25 | U$3.26 84.75,4.25 v84.62,4.25 | v31,9.75 32.25,8.5 51.75,8.5 52.12,8.12 54.38,8.12 54.62,8.38 58.12,8.38 v58.75,7.75
  Bottom 0.152: v5.12,6.5 6.75,4.88 10.25,4.88 v10.25,4.25 | 26.25,24.12 25.38,23.25 v25.38,16.62 27.75,14.25 27.75,13 v31,9.75 | v60.75,14.75 v60.75,9.75 v58.75,7.75 | v84.62,4.25 86.62,4.25 86.62,4 87,3.62 89.75,3.62 v89.75,4.25
WE1  (via drill 0.35)
  Top 0.152: v10.75,23.12 U$1.11
  Bottom 0.152: v10.75,23.12 12.12,21.75 12.12,21.62 12.5,21.25 13.5,21.25 13.5,26.38 14.88,27.75 24.75,27.75 24.75,25.12 23.88,24.25 JP1.3
WE2  (via drill 0.35)
  Top 0.152: U$2.11 39.75,15.75 38.88,14.88 37.25,14.88 37,15.12 25.75,15.12 25.25,15.62 v24.5,15.62
  Bottom 0.152: v24.5,15.62 22.25,17.88 22.25,25.75 JP1.2
WE3  (via drill 0.35)
  Top 0.152: U$3.11 90.75,26.75 95.75,26.75 97.25,25.25 97.25,1.88 76.88,1.88 v76.75,2
  Bottom 0.152: v76.75,2 76.12,1.38 35,1.38 35,3.62 34.38,4.25 32.75,4.25 32.75,3.25 31.75,2.25 29.88,2.25 29.88,6.5 21.38,15 21.38,24.12 JP1.1

### Text on the board
bNames: P1001-001-005-320 - Controller Flash | Copyright 2019, James Wright